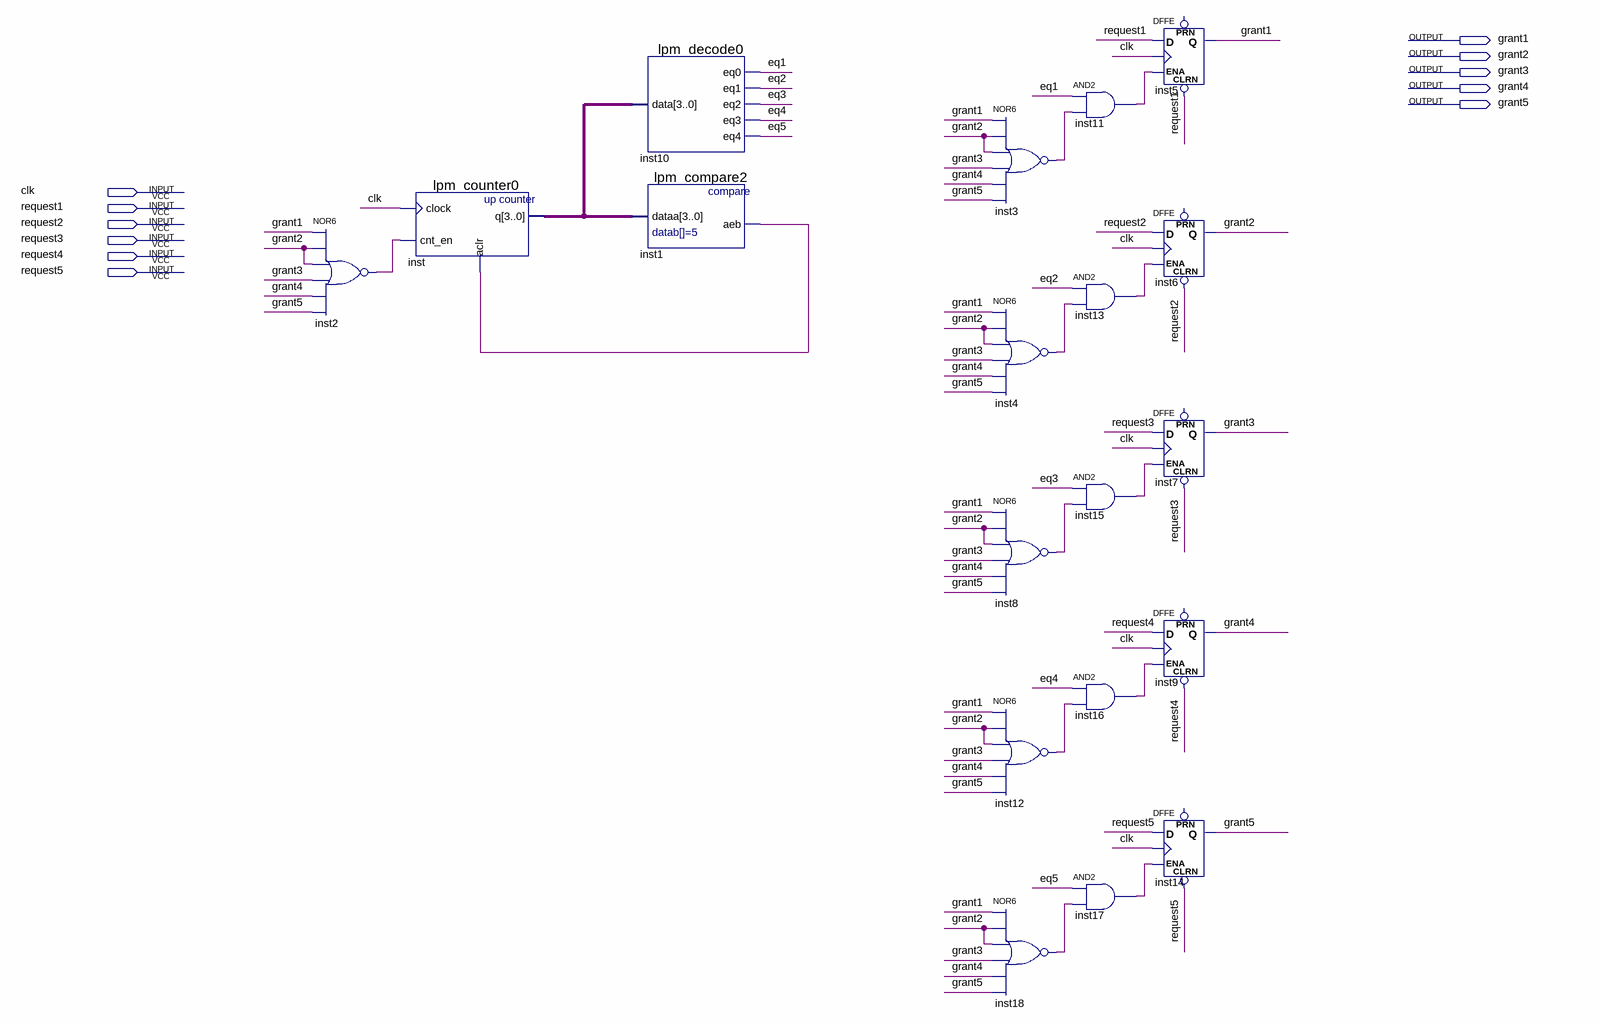
[diagram p0: schematic sheet]
// Quartus schematic Arbitor.bdf as structural Verilog: 19 symbols, 11 pins
module Arbitor (
  input  clk,
  input  request1,
  input  request2,
  input  request3,
  input  request4,
  input  request5,
  output grant1,
  output grant2,
  output grant3,
  output grant4,
  output grant5
);

  wire eq1, eq2, eq3, eq4, eq5, inst1_aeb, inst2_out, inst3_out, inst4_out, inst8_out, inst11_out,
       inst12_out, inst13_out, inst15_out, inst16_out, inst17_out, inst18_out;
  wire [3:0] inst_q;

  nor inst2 (inst2_out, grant1, grant2, grant2, grant3, grant4, grant5);
  lpm_counter0 inst (.clock(clk), .cnt_en(inst2_out), .aclr(inst1_aeb), .q(inst_q));
  lpm_decode0 inst10 (.data(inst_q), .eq0(eq1), .eq1(eq2), .eq2(eq3), .eq3(eq4), .eq4(eq5));
  lpm_compare2 inst1 (.dataa(inst_q), .aeb(inst1_aeb));
  nor inst3 (inst3_out, grant1, grant2, grant2, grant3, grant4, grant5);
  nor inst4 (inst4_out, grant1, grant2, grant2, grant3, grant4, grant5);
  nor inst8 (inst8_out, grant1, grant2, grant2, grant3, grant4, grant5);
  nor inst12 (inst12_out, grant1, grant2, grant2, grant3, grant4, grant5);
  nor inst18 (inst18_out, grant1, grant2, grant2, grant3, grant4, grant5);
  and inst11 (inst11_out, eq1, inst3_out);
  and inst13 (inst13_out, eq2, inst4_out);
  and inst15 (inst15_out, eq3, inst8_out);
  and inst16 (inst16_out, eq4, inst12_out);
  and inst17 (inst17_out, eq5, inst18_out);
  DFFE inst5 (.CLRN(request1), .D(request1), .CLK(clk), .ENA(inst11_out), .Q(grant1));  // open: PRN
  DFFE inst6 (.CLRN(request2), .D(request2), .CLK(clk), .ENA(inst13_out), .Q(grant2));  // open: PRN
  DFFE inst7 (.CLRN(request3), .D(request3), .CLK(clk), .ENA(inst15_out), .Q(grant3));  // open: PRN
  DFFE inst9 (.CLRN(request4), .D(request4), .CLK(clk), .ENA(inst16_out), .Q(grant4));  // open: PRN
  DFFE inst14 (.CLRN(request5), .D(request5), .CLK(clk), .ENA(inst17_out), .Q(grant5));  // open: PRN
endmodule
